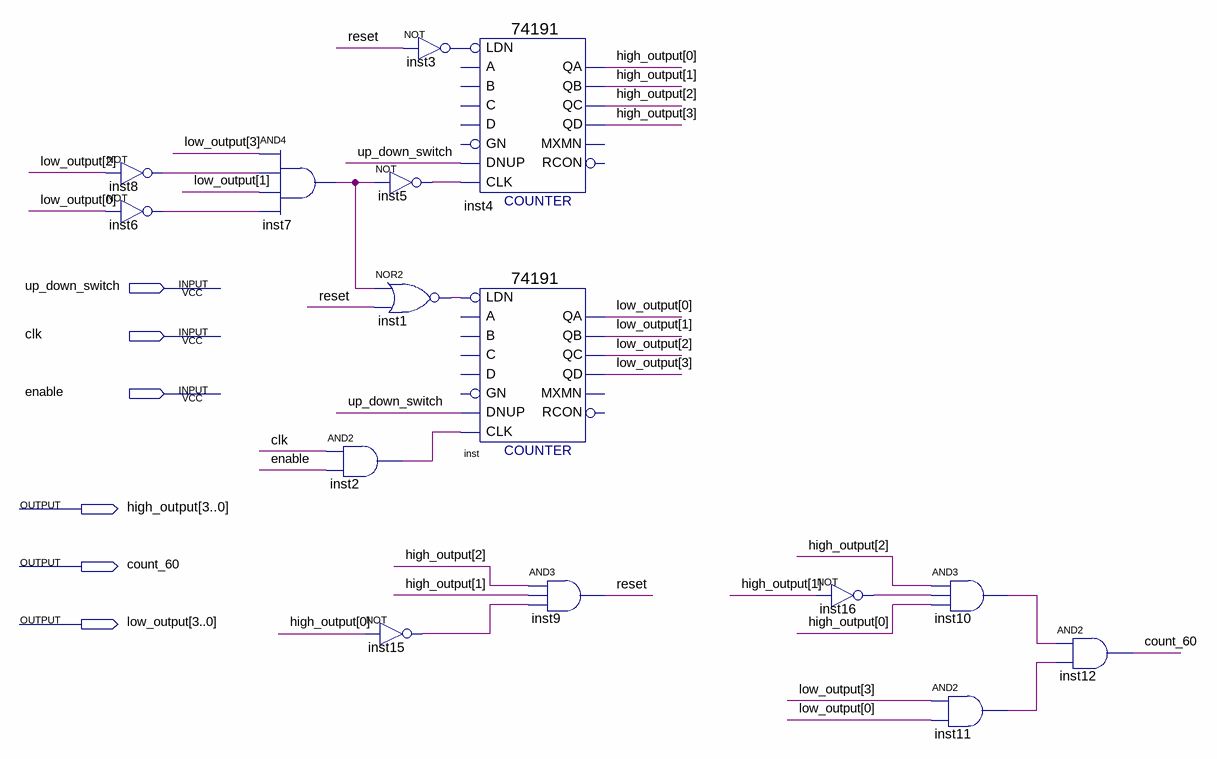
[diagram p0: schematic sheet]
// Quartus schematic counter_60.bdf as structural Verilog: 15 symbols, 6 pins
module counter_60 (
  input  up_down_switch,
  input  clk,
  input  enable,
  output [3:0] high_output,
  output count_60,
  output [3:0] low_output
);

  wire inst1_out, inst2_out, inst3_out, inst5_out, inst6_out, inst7_out, inst8_out, inst10_out, inst11_out,
       inst15_out, inst16_out, reset;

  not inst8 (inst8_out, low_output[2]);
  not inst6 (inst6_out, low_output[0]);
  and inst7 (inst7_out, low_output[3], inst8_out, low_output[1], inst6_out);
  and inst2 (inst2_out, clk, enable);
  not inst3 (inst3_out, reset);
  not inst5 (inst5_out, inst7_out);
  nor inst1 (inst1_out, inst7_out, reset);
  not inst15 (inst15_out, high_output[0]);
  \74191  inst4 (
    .LDN(inst3_out), .CLK(inst5_out), .DNUP(up_down_switch), .QA(high_output[0]), .QB(high_output[1]),
    .QD(high_output[3]), .QC(high_output[2]));  // open: D, C, B, A, GN, RCON, MXMN
  \74191  inst (
    .LDN(inst1_out), .CLK(inst2_out), .DNUP(up_down_switch), .QA(low_output[0]), .QB(low_output[1]),
    .QD(low_output[3]), .QC(low_output[2]));  // open: D, C, B, A, GN, RCON, MXMN
  and inst9 (reset, high_output[2], high_output[1], inst15_out);
  not inst16 (inst16_out, high_output[1]);
  and inst10 (inst10_out, high_output[2], inst16_out, high_output[0]);
  and inst11 (inst11_out, low_output[3], low_output[0]);
  and inst12 (count_60, inst10_out, inst11_out);
endmodule
